# EAGLE design Payload_Computer (EAGLE 6.4)
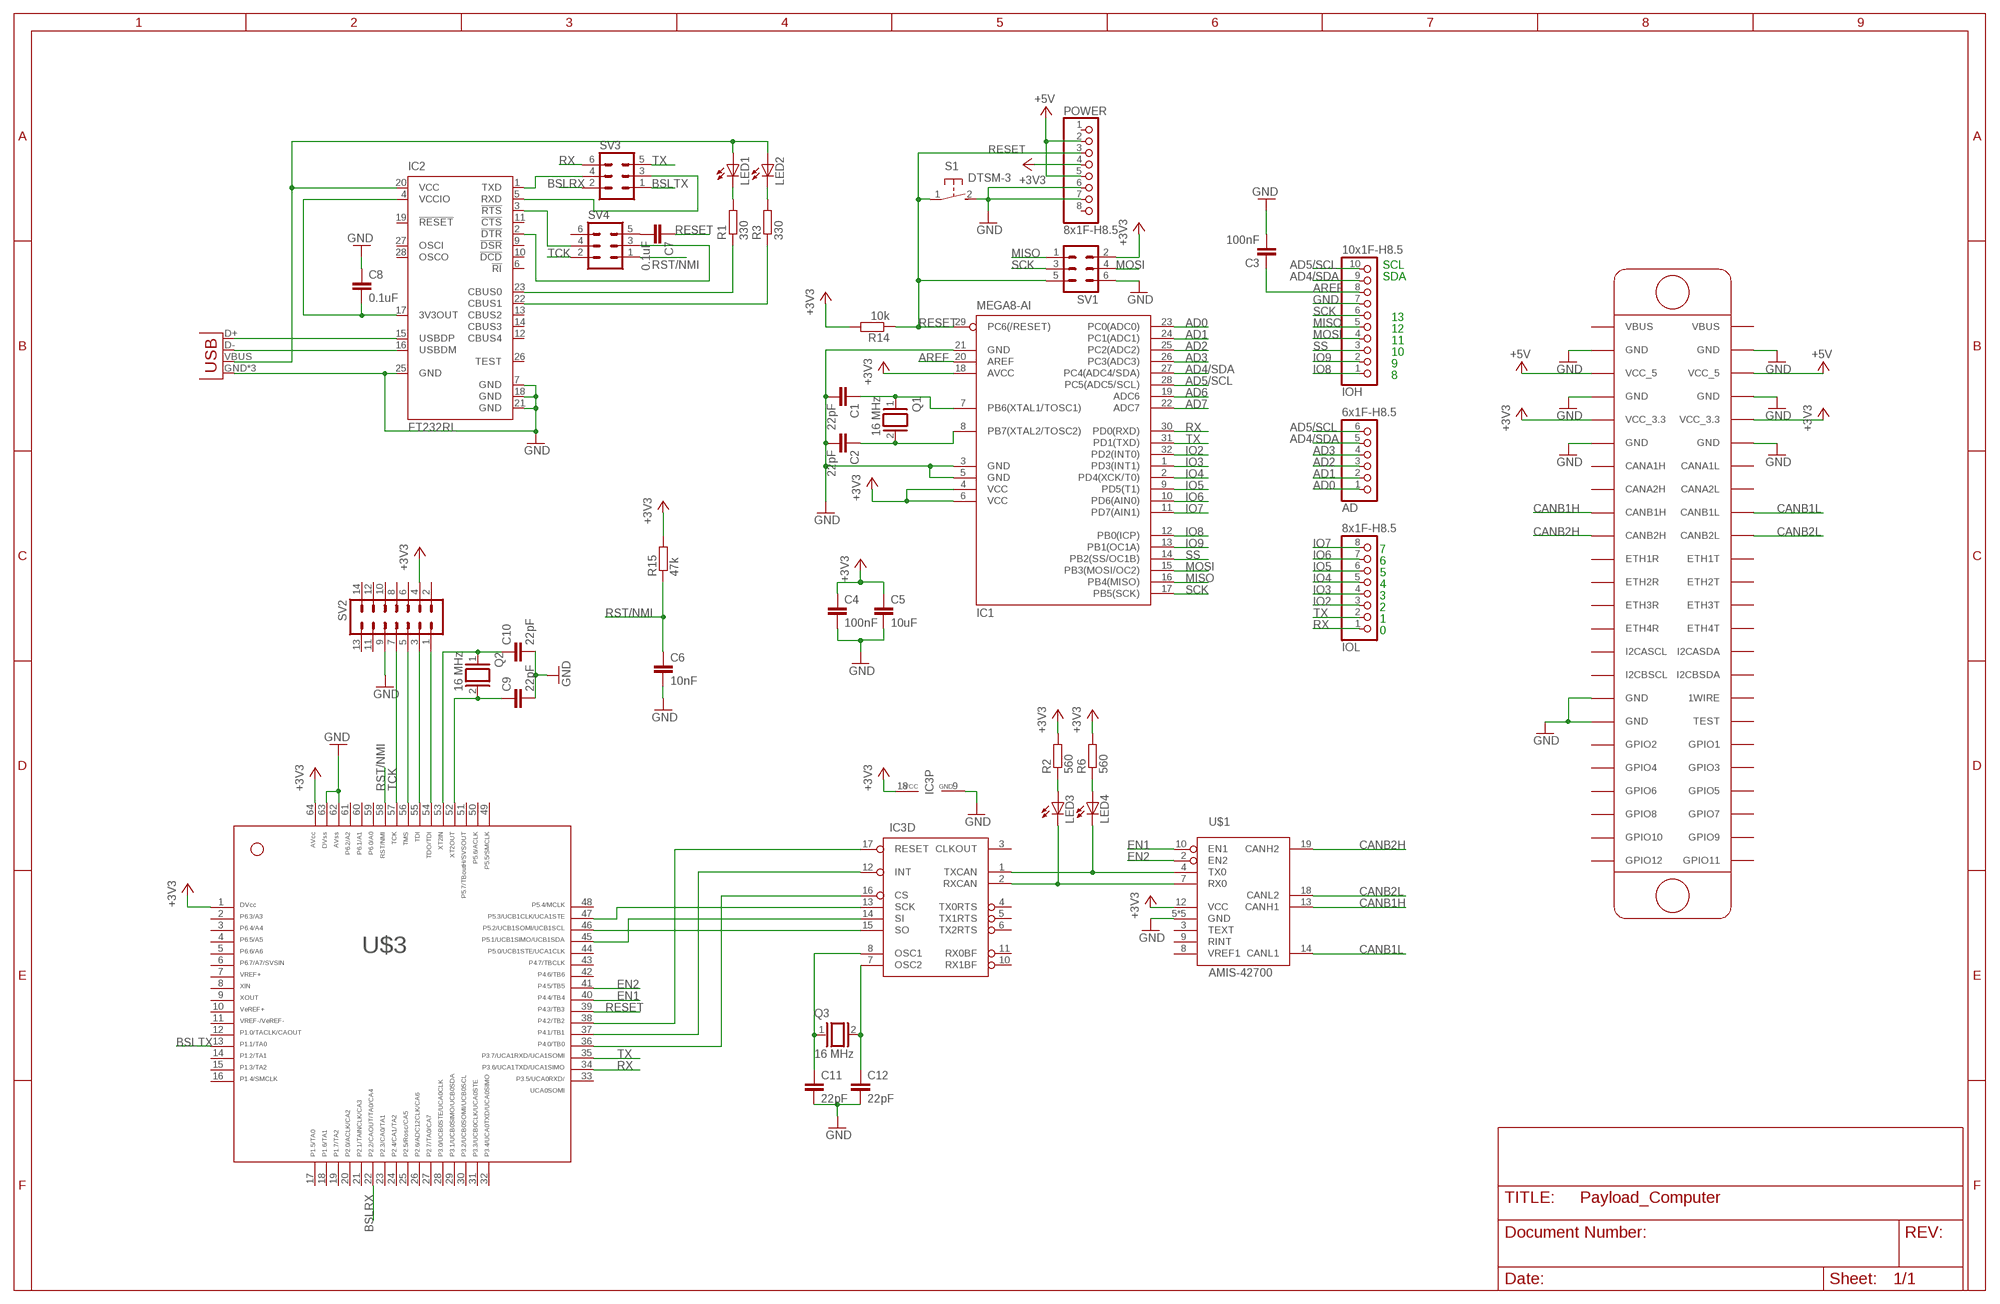
[diagram p0: schematic, sheet 1]

## Parts
AD  6x1F-H8.5  PINHD-1X6  [1X06]
C1  22pF  C-EUC0805  [C0805]
C2  22pF  C-EUC0805  [C0805]
C3  100nF  C-EUC0805  [C0805]
C4  100nF  C-EUC0805  [C0805]
C5  10uF  C-EUC0805  [C0805]
C6  10nF  C-EUC0805  [C0805]
C7  0.1uF  C-EUC0805  [C0805]
C8  0.1uF  C-EUC0805  [C0805]
C9  22pF  C-EUC0805  [C0805]
C10  22pF  C-EUC0805  [C0805]
C11  22pF  C-EUC0805  [C0805]
C12  22pF  C-EUC0805  [C0805]
IC1  MEGA8-AI  [TQFP32-08]
IC2  FT232RL  [SSOP28]
IC3  MCP2515SO  [SO-18W]
IOH  10x1F-H8.5  PINHD-1X10_ARD  [1X10]
IOL  8x1F-H8.5  PINHD-1X8  [1X08]
JP1  USB-MICROB  [USB-MICROB]
LED1  LED3MM  [LED3MM]
LED2  LED3MM  [LED3MM]
LED3  LED3MM  [LED3MM]
LED4  LED3MM  [LED3MM]
POWER  8x1F-H8.5  PINHD-1X8  [1X08]
Q1  16 MHz  XTAL/S  [QS]
Q2  16 MHz  XTAL/S  [QS]
Q3  16 MHz  XTAL/S  [QS]
R1  330  R-EU_R0805  [R0805]
R2  560  R-EU_R0805  [R0805]
R3  330  R-EU_R0805  [R0805]
R6  560  R-EU_R0805  [R0805]
R14  10k  R-EU_R0805  [R0805]
R15  47k  R-EU_R0805  [R0805]
S1  DTSM-3  [DTSM-3]
SV1  MA03-2  [MA03-2]
SV2  MA07-2  [MA07-2]
SV3  MA03-2  [MA03-2]
SV4  MA03-2  [MA03-2]
U$1  AMIS-42700  [SOIC20]
U$2  CUBESAT_PCB  [CUBESAT_PCB]
U$3  F241X---PM64  [PM/PAG64]

## Nets
+3V3: C4.1 C5.1 IC1.4(VCC) IC1.6(VCC) IC1.18(AVCC) IC3.18(P:VCC) POWER.4 R2.2 R6.2 R14.2 R15.2 SV1.2 SV2.4 U$1.12(VCC) U$2.VCC_3.3@1(VCC_3.3) U$2.VCC_3.3@2(VCC_3.3) U$3.1 U$3.64
+5V [usbvcc]: POWER.2 POWER.5 U$2.VCC_5@1(VCC_5) U$2.VCC_5@2(VCC_5)
AD0: AD.1 IC1.23(PC0(ADC0))
AD1: AD.2 IC1.24(PC1(ADC1))
AD2: AD.3 IC1.25(PC2(ADC2))
AD3: AD.4 IC1.26(PC3(ADC3))
AD4/SDA: AD.5 IC1.27(PC4(ADC4/SDA)) IOH.9
AD5/SCL: AD.6 IC1.28(PC5(ADC5/SCL)) IOH.10
AD6: IC1.19(ADC6)
AD7: IC1.22(ADC7)
AREF [aref]: C3.1 IC1.20(AREF) IOH.8
BSLRX: SV3.2 U$3.22
BSLTX: SV3.1 U$3.13
CANB1H: U$1.13(CANH1) U$2.CANB1H
CANB1L: U$1.14(CANL1) U$2.CANB1L
CANB2H: U$1.19(CANH2) U$2.CANB2H
CANB2L: U$1.18(CANL2) U$2.CANB2L
EN1: U$1.10(EN1) U$3.40
EN2: U$1.2(EN2) U$3.41
GND [gnd]: C1.2 C2.2 C3.2 C4.2 C5.2 C6.2 C8.1 C9.2 C10.2 C11.2 C12.2 IC1.3(GND) IC1.5(GND) IC1.21(GND) IC2.7(GND) IC2.18(GND) IC2.21(GND) IC2.25(GND) IC3.9(P:GND) IOH.7 JP1.GND JP1.MT1(GND) JP1.MT2(GND) POWER.6 POWER.7 S1.2 SV1.6 SV2.9 U$1.5(GND) U$1.6(GND) U$1.15(GND) U$1.16(GND) U$1.17(GND) U$2.GND@5(GND) U$2.GND@6(GND) U$2.GND@7(GND) U$2.GND@8(GND) U$2.GND@9(GND) U$2.GND@10(GND) U$2.GND@11(GND) U$2.GND@12(GND) U$3.62 U$3.63
IO2: IC1.32(PD2(INT0)) IOL.3
IO3: IC1.1(PD3(INT1)) IOL.4
IO4: IC1.2(PD4(XCK/T0)) IOL.5
IO5: IC1.9(PD5(T1)) IOL.6
IO6: IC1.10(PD6(AIN0)) IOL.7
IO7: IC1.11(PD7(AIN1)) IOL.8
IO8: IC1.12(PB0(ICP)) IOH.1
IO9: IC1.13(PB1(OC1A)) IOH.2
MISO: IC1.16(PB4(MISO)) IOH.5 SV1.1
MOSI: IC1.15(PB3(MOSI/OC2)) IOH.4 SV1.4
N$1: IC3.1(D:TXCAN) LED4.K(C) U$1.4(TX0)
N$2: C12.1 IC3.7(D:OSC2) Q3.2
N$3: IC3.2(D:RXCAN) LED3.K(C) U$1.7(RX0)
N$4: C8.2 IC2.4(VCCIO) IC2.17(3V3OUT)
N$5: IC2.15(USBDP) JP1.D+
N$6: IC2.16(USBDM) JP1.D-
N$7: IC2.20(VCC) JP1.VBUS LED1.A LED2.A
N$8: LED1.K(C) R1.2
N$9: LED2.K(C) R3.2
N$10: IC2.23(CBUS0) R1.1
N$11: IC2.22(CBUS1) R3.1
N$12: LED3.A R2.1
N$13: LED4.A R6.1
N$14: C7.2 SV4.5
N$15: IC2.1(TXD) SV3.4
N$16: IC2.5(RXD) SV3.3
N$17: IC2.2(!DTR) SV4.3
N$18: C1.1 IC1.7(PB6(XTAL1/TOSC1)) Q1.1
N$19: C2.1 IC1.8(PB7(XTAL2/TOSC2)) Q1.2
N$20: C11.1 IC3.8(D:OSC1) Q3.1
N$23: SV2.1 U$3.54
N$24: SV2.3 U$3.55
N$25: SV2.5 U$3.56
N$26: IC2.3(!RTS) SV4.4
N$27: IC3.15(D:SO) U$3.46
N$28: IC3.14(D:SI) U$3.45
N$29: IC3.13(D:SCK) U$3.47
N$31: IC3.16(D:CS) U$3.36
N$32: IC3.12(D:INT) U$3.37
N$33: IC3.17(D:RESET) U$3.38
RESET: C7.1 IC1.29(PC6(/RESET)) POWER.3 R14.1 S1.1 SV1.5 U$3.39
RST/NMI: C6.1 R15.1 SV4.1 U$3.58
RX: IC1.30(PD0(RXD)) IOL.1 SV3.6 U$3.34
SCK: IC1.17(PB5(SCK)) IOH.6 SV1.3
SS: IC1.14(PB2(SS/OC1B)) IOH.3
TCK: SV2.7 SV4.2 U$3.57
TX: IC1.31(PD1(TXD)) IOL.2 SV3.5 U$3.35
XT2IN: C10.1 Q2.1 U$3.53
XT2OUT: C9.1 Q2.2 U$3.52
Unconnected: IC2.6(!RI) IC2.9(!DSR) IC2.10(!DCD) IC2.11(!CTS) IC2.12(CBUS4) IC2.13(CBUS2) IC2.14(CBUS3) IC2.19(!RESET) IC2.26(TEST) IC2.27(OSCI) IC2.28(OSCO) IC3.3(D:CLKOUT) IC3.4(D:TX0RTS) IC3.5(D:TX1RTS) IC3.6(D:TX2RTS) IC3.10(D:RX1BF) IC3.11(D:RX0BF) POWER.1 POWER.8 SV2.2 SV2.6 SV2.8 SV2.10 SV2.11 SV2.12 SV2.13 SV2.14 SV4.6 U$1.3(TEXT) U$1.8(VREF1) U$1.9(RINT) U$2.1WIRE U$2.CANA1H U$2.CANA1L U$2.CANA2H U$2.CANA2L U$2.ETH1R U$2.ETH1T U$2.ETH2R U$2.ETH2T U$2.ETH3R U$2.ETH3T U$2.ETH4R U$2.ETH4T U$2.GPIO1 U$2.GPIO2 U$2.GPIO3 U$2.GPIO4 U$2.GPIO5 U$2.GPIO6 U$2.GPIO7 U$2.GPIO8 U$2.GPIO9 U$2.GPIO10 U$2.GPIO11 U$2.GPIO12 U$2.I2CASCL U$2.I2CASDA U$2.I2CBSCL U$2.I2CBSDA U$2.TEST U$2.VBUS@1(VBUS) U$2.VBUS@2(VBUS) U$3.2 U$3.3 U$3.4 U$3.5 U$3.6 U$3.7 U$3.8 U$3.9 U$3.10 U$3.11 U$3.12 U$3.14 U$3.15 U$3.16 U$3.17 U$3.18 U$3.19 U$3.20 U$3.21 U$3.23 U$3.24 U$3.25 U$3.26 U$3.27 U$3.28 U$3.29 U$3.30 U$3.31 U$3.32 U$3.33 U$3.42 U$3.43 U$3.44 U$3.48 U$3.49 U$3.50 U$3.51 U$3.59 U$3.60 U$3.61

## Notes on the sheet
- SCL
- SDA
- 13
- 12
- 11
- 10
- 9
- 8
- 7
- 6
- 5
- 4
- 3
- 2
- 1
- 0

## Library data of the parts
AD = SmartPrj:PINHD-1X6: PIN HEADER
C1-C12 = resistor:C-EU: CAPACITOR, European symbol
IC1 = atmel:MEGA8: MICROCONTROLLER 8 Kbytes FLASH, 1 kbytes SRAM, 512 bytes EEPROM, USART, 6-channel 10 bit ADC, 2-channel 8 bit ADC Pin compatible with Atmega48, ATMega88, ATMega168 Source: avr.lbr; MPN: ATMEGA8-16AU; OC_FARNELL: 9171371; OC_NEWARK: 73M8863
IC2 = ftdichip:FT232R: Source: http://www.ftdichip.com/Documents/DataSheets/DS_FT232R_v104.pdf; MPN: FT232RL; OC_FARNELL: 1146032; OC_NEWARK: 91K9918
IC3 = can:MCP2515: MC2515 Stand-Alone CAN Controller With SPI Interface, Microchip
IOH = SmartPrj:PINHD-1X10_ARD: PIN HEADER
IOL POWER = SmartPrj:PINHD-1X8: PIN HEADER
JP1 = SparkFun-Connectors:USB: USB Connectors USB-B-PTH is fully proven SKU : PRT-00139/CONN-08278 USB-miniB is fully proven SKU : PRT-00587 USB-A-PCB is untested. USB-A-H is throughly reviewed, but untested. Spark Fun Electronics SKU : PRT-00437 USB-B-SMT is throughly reviewed, but untested. Needs silkscreen touching up. USB-A-S has not been used/tested USB-MB-H has not been used/tested USB-MICROB has been used. CONN-09505; PROD_ID: CONN-09505
LED1-LED4 = SparkFun-LED:LED: LEDs Standard schematic elements and footprints for 5mm, 3mm, 1206, and 0603 sized LEDs. 5mm - Spark Fun Electronics SKU : COM-00529 (and others)
Q1-Q3 = special:XTAL/S: CRYSTAL
R1-R3 R6 R14 R15 = resistor:R-EU_: RESISTOR, European symbol
S1 = switch-tact:DTSM-3
SV1 SV3 SV4 = con-lstb:MA03-2: PIN HEADER; OC_FARNELL: unknown; OC_NEWARK: unknown
SV2 = con-lstb:MA07-2: PIN HEADER; OC_FARNELL: unknown; OC_NEWARK: unknown
U$1 = amis-42700:AMIS-42700
U$2 = CubeSat_PCB:CUBESAT_PCB: OpenCube PCB
U$3 = TI_MSP430_v16:F241X---PM64: ***MSP430F241x***PM64

## Net classes
0 default: width 0.152 mm, clearance 0.152 mm
1 power: width 0.152 mm, drill 0.61 mm, clearance 0.152 mm
2 gnd: width 0.152 mm, drill 0.559 mm, clearance 0.152 mm
3 usbvcc: width 0.152 mm, drill 0.61 mm, clearance 0.152 mm
4 aref: width 0.152 mm, drill 0.61 mm, clearance 0.152 mm

## Board
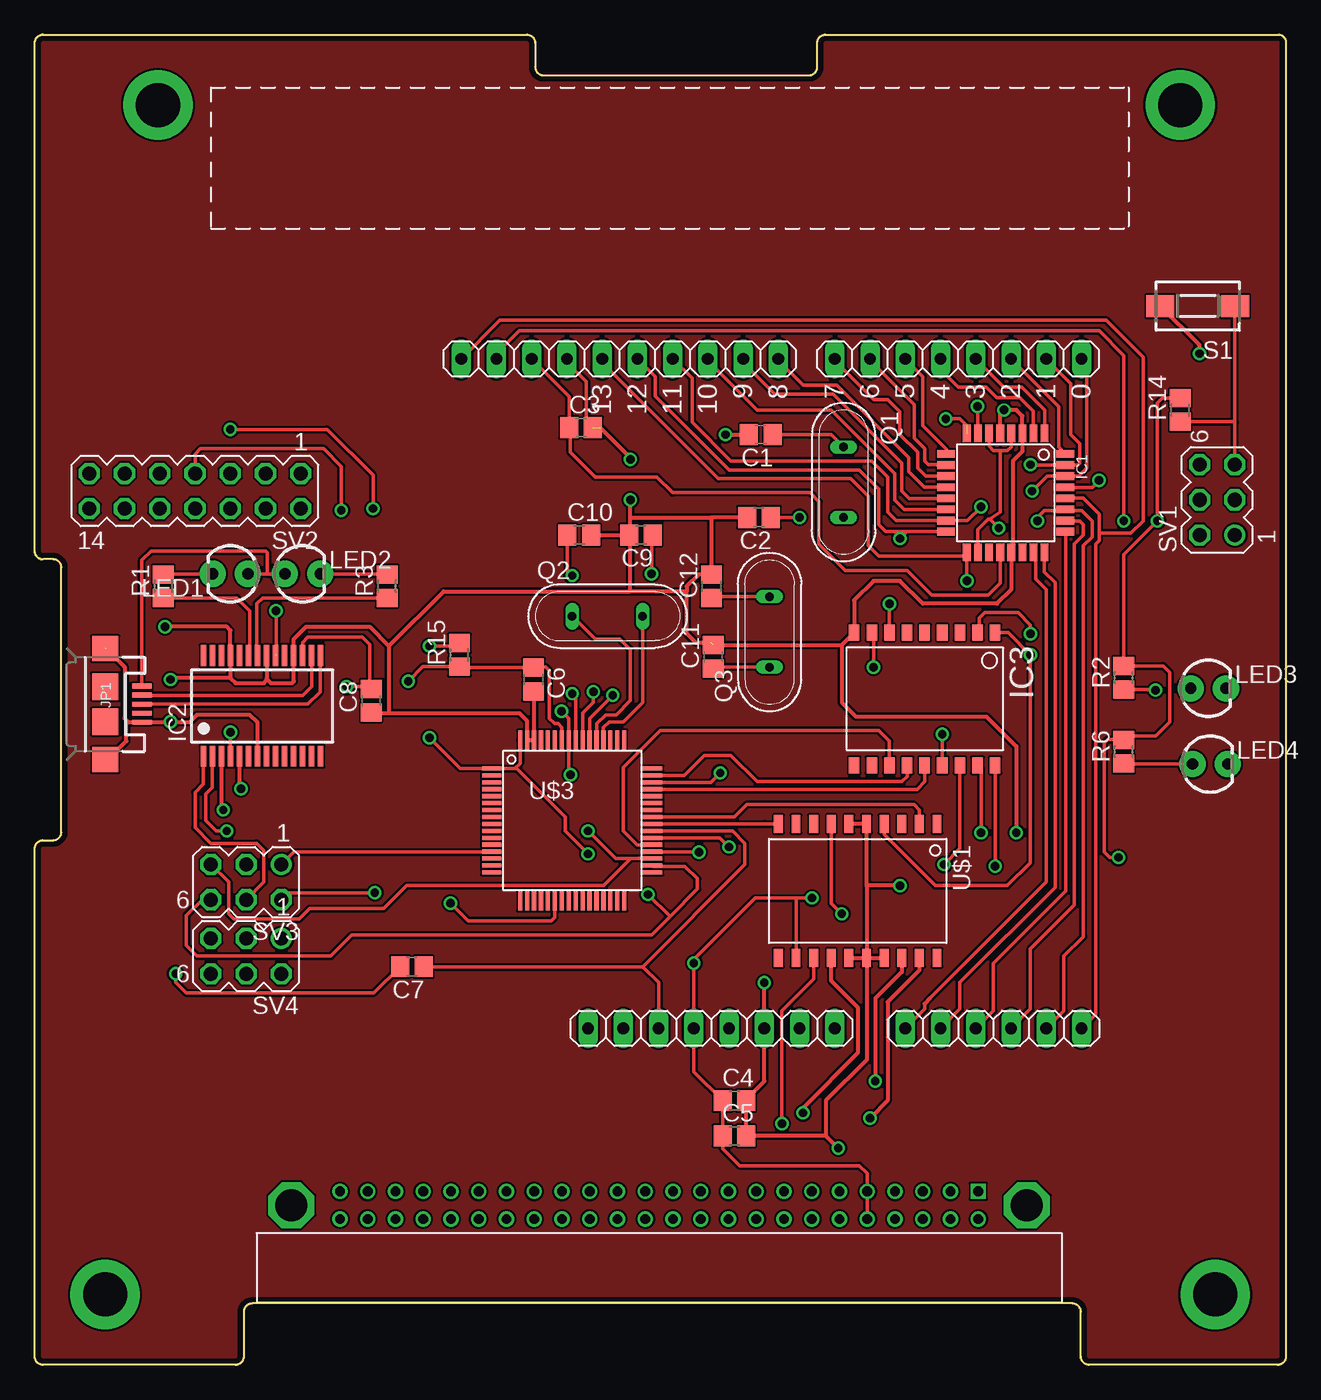
[diagram p1: board, top side]
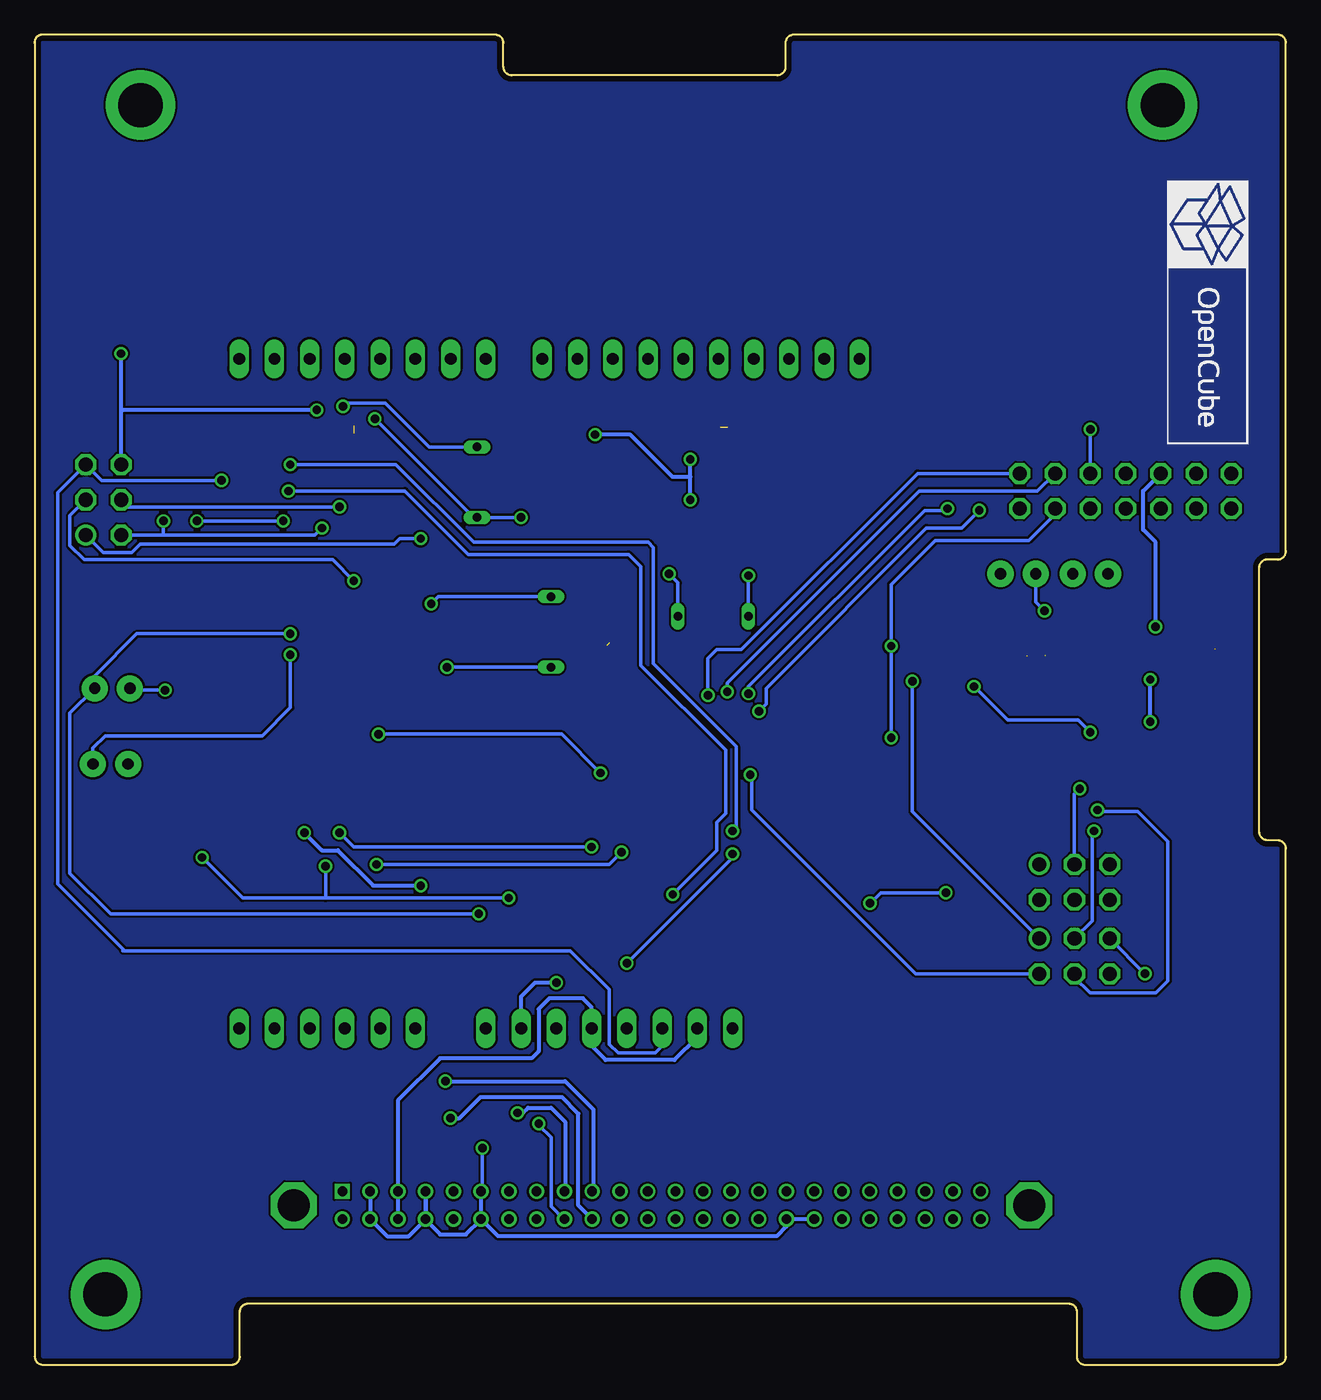
[diagram p2: board, bottom side, seen from below]

Size 90.17 x 95.89 mm. Coordinates in mm from the lower left corner, seen from the top.
Copper layers (1*16): Top 0.0356mm / dielectric 1.5011mm / Bottom 0.0356mm
Design rules "LaenPCBOrder": minimum track width 6mil, minimum drill 13mil, track to track 6mil, track to pad 6mil, pad to pad 6mil, via to via 6mil, smd to smd 6mil, copper to edge 15mil, drill to drill 6mil, minimum pad ring 7mil, minimum via ring 7mil, stop-mask expansion 3mil, vias tented up to drill 0mil, thermal gap 10mil

### Footprints (pad centres in the part's own frame; a part is rotated, then mirrored left to right if it is on the bottom)
1X06 = drill 0.85 pad 1.422 long: 1 -6.35,0; 2 -3.81,0; 3 -1.27,0; 4 1.27,0; 5 3.81,0; 6 6.35,0
C0805 = smd 1.3 x 1.5: 1 -0.85,0; 2 0.85,0
TQFP32-08 = smd 1.27 x 0.559: 1 -4.293,2.8; 2 -4.293,2; 3 -4.293,1.2; 4 -4.293,0.4; 5 -4.293,-0.4; 6 -4.293,-1.2; 7 -4.293,-2; 8 -4.293,-2.8; 17 4.293,-2.8; 18 4.293,-2; 19 4.293,-1.2; 20 4.293,-0.4; 21 4.293,0.4; 22 4.293,1.2; 23 4.293,2; 24 4.293,2.8 | smd 0.559 x 1.27: 9 -2.8,-4.293; 10 -2,-4.293; 11 -1.2,-4.293; 12 -0.4,-4.293; 13 0.4,-4.293; 14 1.2,-4.293; 15 2,-4.293; 16 2.8,-4.293; 25 2.8,4.293; 26 2,4.293; 27 1.2,4.293; 28 0.4,4.293; 29 -0.4,4.293; 30 -1.2,4.293; 31 -2,4.293; 32 -2.8,4.293
SSOP28 = smd 0.4 x 1.5: 1 -4.225,-3.625; 2 -3.575,-3.625; 3 -2.925,-3.625; 4 -2.275,-3.625; 5 -1.625,-3.625; 6 -0.975,-3.625; 7 -0.325,-3.625; 8 0.325,-3.625; 9 0.975,-3.625; 10 1.625,-3.625; 11 2.275,-3.625; 12 2.925,-3.625; 13 3.575,-3.625; 14 4.225,-3.625; 15 4.225,3.625; 16 3.575,3.625; 17 2.925,3.625; 18 2.275,3.625; 19 1.625,3.625; 20 0.975,3.625; 21 0.325,3.625; 22 -0.325,3.625; 23 -0.975,3.625; 24 -1.625,3.625; 25 -2.275,3.625; 26 -2.925,3.625; 27 -3.575,3.625; 28 -4.225,3.625
SO-18W = smd 0.762 x 1.143: 1 -5.08,-4.788; 2 -3.81,-4.788; 3 -2.54,-4.788; 4 -1.27,-4.788; 5 0,-4.788; 6 1.27,-4.788; 7 2.54,-4.788; 8 3.81,-4.788; 9 5.08,-4.788; 10 5.08,4.788; 11 3.81,4.788; 12 2.54,4.788; 13 1.27,4.788; 14 0,4.788; 15 -1.27,4.788; 16 -2.54,4.788; 17 -3.81,4.788; 18 -5.08,4.788
1X10@1 = drill 0.85 pad 1.422 long: 1 -11.43,0; 2 -8.89,0; 3 -6.35,0; 4 -3.81,0; 5 -1.27,0; 6 1.27,0; 7 3.81,0; 8 6.35,0; 9 8.89,0; 10 11.43,0
1X08 = drill 0.85 pad 1.422 long: 1 -8.89,0; 2 -6.35,0; 3 -3.81,0; 4 -1.27,0; 5 1.27,0; 6 3.81,0; 7 6.35,0; 8 8.89,0
USB-MICROB = smd 0.35 x 1.4: D+ 0,2.65; D- -0.65,2.65; GND 1.3,2.65; ID 0.65,2.65; VBUS -1.3,2.65 | smd 1.8 x 1.9: MT1 -4,0; MT2 4,0 | smd 1.9 x 1.9: P$1 -1.27,0; P$2 1.27,0
LED3MM = drill 0.813 pad 1.88: A -1.27,0; K 1.27,0
QS = drill 0.61 long: 1 -2.54,0; 2 2.54,0
R0805 = smd 1.3 x 1.5: 1 -0.85,0; 2 0.85,0
DTSM-3 = smd 2 x 1.6: 1 -2.7,0; 2 2.7,0
MA03-2 = drill 1.016: 1 -2.54,-1.27 | drill 1.016 octagon: 2 -2.54,1.27; 3 0,-1.27; 4 0,1.27; 5 2.54,-1.27; 6 2.54,1.27
MA07-2 = drill 1.016 octagon: 1 -7.62,-1.27; 2 -7.62,1.27; 3 -5.08,-1.27; 4 -5.08,1.27; 5 -2.54,-1.27; 6 -2.54,1.27; 7 0,-1.27; 8 0,1.27; 9 2.54,-1.27; 10 2.54,1.27; 11 5.08,-1.27; 12 5.08,1.27; 13 7.62,-1.27; 14 7.62,1.27
SOIC20 = smd 1.27 x 0.635: 1 -4.826,5.715; 2 -4.826,4.445; 3 -4.826,3.175; 4 -4.826,1.905; 5 -4.826,0.635; 6 -4.826,-0.635; 7 -4.826,-1.905; 8 -4.826,-3.175; 9 -4.826,-4.445; 10 -4.826,-5.715; 11 4.826,-5.715; 12 4.826,-4.445; 13 4.826,-3.175; 14 4.826,-1.905; 15 4.826,-0.635; 16 4.826,0.635; 17 4.826,1.905; 18 4.826,3.175; 19 4.826,4.445; 20 4.826,5.715
CUBESAT_PCB = drill 0.7 pad 1.1: 1WIRE 36,12.5; CANA1H 56,10.5; CANA1L 56,12.5; CANA2H 54,10.5; CANA2L 54,12.5; CANB1H 52,10.5; CANB1L 52,12.5; CANB2H 50,10.5; CANB2L 50,12.5; ETH1R 48,10.5; ETH1T 48,12.5; ETH2R 46,10.5; ETH2T 46,12.5; ETH3R 44,10.5; ETH3T 44,12.5; ETH4R 42,10.5; ETH4T 42,12.5; GND@5 66,12.5; GND@6 66,10.5; GND@7 62,12.5; GND@8 62,10.5; GND@9 58,12.5; GND@10 58,10.5; GND@11 36,10.5; GND@12 34,10.5; GPIO1 32,12.5; GPIO2 32,10.5; GPIO3 30,12.5; GPIO4 30,10.5; GPIO5 28,12.5; GPIO6 28,10.5; GPIO7 26,12.5; GPIO8 26,10.5; GPIO9 24,12.5; GPIO10 24,10.5; GPIO11 22,12.5; GPIO12 22,10.5; I2CASCL 40,10.5; I2CASDA 40,12.5; I2CBSCL 38,10.5; I2CBSDA 38,12.5; TEST 34,12.5; VBUS@2 68,10.5; VCC_3.3@1 60,12.5; VCC_3.3@2 60,10.5; VCC_5@1 64,12.5; VCC_5@2 64,10.5 | drill 3.18 pad 5: GND@1 5.08,5.08; GND@2 8.89,90.81; GND@3 82.55,90.81; GND@4 85.08,5.08 | drill 2.3 pad 3.2 octagon: GND@13 18.5,11.5; GND@14 71.5,11.5 | drill 0.7 pad 1.1 square: VBUS@1 68,12.5
PM/PAG64 = smd 1.4 x 0.3: 1 -5.8,3.75; 2 -5.8,3.25; 3 -5.8,2.75; 4 -5.8,2.25; 5 -5.8,1.75; 6 -5.8,1.25; 7 -5.8,0.75; 8 -5.8,0.25; 9 -5.8,-0.25; 10 -5.8,-0.75; 11 -5.8,-1.25; 12 -5.8,-1.75; 13 -5.8,-2.25; 14 -5.8,-2.75; 15 -5.8,-3.25; 16 -5.8,-3.75; 33 5.8,-3.75; 34 5.8,-3.25; 35 5.8,-2.75; 36 5.8,-2.25; 37 5.8,-1.75; 38 5.8,-1.25; 39 5.8,-0.75; 40 5.8,-0.25; 41 5.8,0.25; 42 5.8,0.75; 43 5.8,1.25; 44 5.8,1.75; 45 5.8,2.25; 46 5.8,2.75; 47 5.8,3.25; 48 5.8,3.75 | smd 0.3 x 1.4: 17 -3.75,-5.8; 18 -3.25,-5.8; 19 -2.75,-5.8; 20 -2.25,-5.8; 21 -1.75,-5.8; 22 -1.25,-5.8; 23 -0.75,-5.8; 24 -0.25,-5.8; 25 0.25,-5.8; 26 0.75,-5.8; 27 1.25,-5.8; 28 1.75,-5.8; 29 2.25,-5.8; 30 2.75,-5.8; 31 3.25,-5.8; 32 3.75,-5.8; 49 3.75,5.8; 50 3.25,5.8; 51 2.75,5.8; 52 2.25,5.8; 53 1.75,5.8; 54 1.25,5.8; 55 0.75,5.8; 56 0.25,5.8; 57 -0.25,5.8; 58 -0.75,5.8; 59 -1.25,5.8; 60 -1.75,5.8; 61 -2.25,5.8; 62 -2.75,5.8; 63 -3.25,5.8; 64 -3.75,5.8

### Placement (x,y rotation side)
AD  69.09,24.26 0 top
C1  52.32,67.06 180 top
C2  52.2,61.09 180 top
C3  39.37,67.56 0 top
C4  50.42,19.05 0 top
C5  50.42,16.51 0 top
C6  35.94,49.4 270 top
C7  27.18,28.7 180 top
C8  24.26,47.88 90 top
C9  43.69,59.82 180 top
C10  39.24,59.82 0 top
C11  48.9,51.05 90 top
C12  48.77,56.13 90 top
IC1  69.98,62.87 270 top
IC2  16.38,47.5 0 top
IC3  64.14,48.01 180 top
IOH  10x1F-H8.5  [1X10@1]  42.16,72.52 180 top
IOL  66.55,72.52 180 top
JP1  5.08,47.62 270 top
LED1  14.1,57.02 180 top
LED2  19.3,57.02 0 top
LED3  84.58,48.77 0 top
LED4  84.71,43.31 0 top
POWER  48.77,24.26 0 top
Q1  58.29,63.63 270 top
Q2  41.27,53.98 0 top
Q3  52.96,52.83 90 top
R1  9.27,56.13 90 top
R2  78.49,49.53 90 top
R3  25.4,56.13 90 top
R6  78.49,44.2 90 top
R14  82.55,68.83 90 top
R15  30.61,51.18 90 top
S1  83.82,76.33 180 top
SV1  85.22,62.36 90 top
SV2  11.56,62.99 180 top
SV3  15.24,34.8 180 top
SV4  15.24,29.46 180 top
U$1  59.31,34.16 270 top
U$2  0,0 0 top
U$3  38.73,39.24 0 top

### Tracks (layer width: path | path; a pad name or v marks a point on that pad's centre or on a via)
+3V3  (via drill 0.6)
  Top 0.254: IC1.6 68.78,66.22 69.09,65.91 69.6,65.91 | 69.6,65.91 70.1,65.91 70.36,66.17 70.36,67.14 IC1.4 | IC1.18 67.98,60.23 68.71,60.96 68.83,60.96 | 69.6,65.91 69.6,61.47 68.83,60.96 | v69.47,60.33 68.83,60.96 | R14.2 81.24,69.68 80.9,69.34 v80.9,60.83 78.49,58.42 R2.2 81.32,50.38 81.79,49.91 81.79,46.36 80.77,45.34 78.78,45.34 R6.2 78.45,45.09 77.34,45.09 77.09,44.83 77.09,36.96 77.47,36.58 v78.11,36.58 | v28.45,45.21 30.67,42.99 U$3.1 34.61,42.99 | 30.39,51.82 R15.2 30.1,52.03 30.1,51.82 v28.45,51.82 | 54.86,29.08 U$1.12 54.86,33.66 | IC3.18 v69.22,35.94 | U$3.64 34.98,43.37 34.61,42.99 | 34.61,42.99 34.73,42.99 38.23,39.5 38.23,38.48 v39.88,36.83 | U$2.VCC_3.3@2 U$2.VCC_3.3@1 60,13.79 59.44,14.35 50.8,14.35 49.57,15.58 C5.1 C4.1 47.5,21.12 POWER.4 v47.5,28.96 47.5,29.21 51.94,33.66 54.86,33.66 | 54.86,33.66 v56.01,33.66
  Bottom 0.254: SV1.2 80.9,59.82 | 80.9,59.82 69.98,59.82 v69.47,60.33 | v80.9,60.83 80.9,59.82 | v28.45,45.21 v28.45,51.82 28.45,56.26 25.27,59.44 18.54,59.44 16.64,61.34 SV2.4 | v56.01,33.66 69.22,33.66 | 69.22,33.66 75.18,33.66 v78.11,36.58 | v69.22,35.94 69.22,33.66 | v39.88,36.83 39.88,36.58 v47.5,28.96
+5V
  Bottom 0.305: POWER.2 42.42,23.62 44.07,21.97 49.02,21.97 50.04,22.99 POWER.5 50.04,25.78 50.67,26.42 53.09,26.42 53.85,25.65 53.85,22.61 54.36,22.1 60.96,22.1 64.01,19.05 U$2.VCC_5@1 U$2.VCC_5@2
AD0
  Top 0.254: IC1.23 72.14,58.41 72.14,56.64 72.9,55.88 72.9,34.8 64.52,26.42 | 64.14,26.04 64.14,25.65 AD.1
  Top 0.305: 64.52,26.42 64.14,26.04
AD1
  Top 0.254: IC1.24 72.77,57.15 73.53,56.39 73.53,34.42 66.67,27.56 66.67,25.65 AD.2
AD2
  Top 0.254: IC1.25 74.3,60.04 74.3,34.16 69.09,28.96 69.09,25.53 AD.3
AD3
  Top 0.254: IC1.26 74.3,60.83 75.31,60.83 75.56,60.58 75.56,59.82 74.93,59.18 74.93,33.15 71.75,29.97 71.75,25.65 AD.4
AD4/SDA  (via drill 0.6)
  Top 0.254: v78.49,60.83 78.49,72.77 76.71,74.55 34.93,74.55 33.27,72.9 IOH.9 | v72.26,60.83 72.26,61.09 72.77,61.59 74.2,61.59 IC1.27 74.34,61.59 75.44,61.59 76.2,60.83 76.2,59.69 75.56,59.06 75.56,30.86 74.17,29.46 74.17,25.53 AD.5
  Bottom 0.254: v78.49,60.83 v72.26,60.83
AD5/SCL
  Top 0.254: 76.71,60.07 76.71,59.44 76.45,59.18 76.45,25.27 AD.6 | 76.71,60.07 76.71,61.34 75.56,62.48 74.29,62.48 IC1.28 | 76.71,60.07 76.84,59.94 78.99,59.94 79.88,60.83 79.88,72.64 77.22,75.31 33.53,75.31 IOH.10
AREF
  Top 0.254: IOH.8 38.52,69.81 C3.1 38.61,67.48 38.61,65.79 40.39,64.01 44.83,64.01 45.97,62.87 55.88,62.87 56.52,62.23 56.52,59.18 58.42,57.28 62.87,57.28 64.64,55.5 68.71,55.5 69.58,56.37 IC1.20
BSLRX  (via drill 0.6)
  Top 0.254: U$3.22 37.47,33.42 37.47,32.26 37.21,32 31.24,32 v29.97,33.27 | v24.51,34.04 18.29,34.04 SV3.2
  Bottom 0.254: v24.51,34.04 29.21,34.04 v29.97,33.27
BSLTX
  Top 0.254: U$3.13 32.9,36.96 18.67,36.96 SV3.1
CANB1H  (via drill 0.6)
  Top 0.254: v53.85,17.4 53.85,25.53 56.13,27.81 U$1.13
  Bottom 0.254: U$2.CANB1H 52.03,10.5 52.96,11.43 52.96,16.38 53.85,17.27 v53.85,17.4
CANB1L  (via drill 0.6)
  Top 0.305: v55.37,18.16 55.37,18.54 59.31,22.48 59.31,25.78 57.4,27.69 U$1.14
  Bottom 0.305: U$2.CANB1L 51.94,12.56 51.94,17.53 52.96,18.54 54.61,18.54 54.99,18.16 v55.37,18.16
CANB2H  (via drill 0.6)
  Top 0.305: U$1.19 63.75,28.45 61.47,26.16 61.47,19.05 v60.2,17.78
  Bottom 0.305: v60.2,17.78 59.56,17.78 58.04,19.3 52.2,19.3 50.99,18.1 50.99,11.49 U$2.CANB2H
CANB2L  (via drill 0.6)
  Top 0.305: U$1.18 62.48,28.32 60.58,26.42 v60.58,20.45
  Bottom 0.305: v60.58,20.45 51.94,20.45 49.91,18.42 49.91,12.59 U$2.CANB2L
EN1
  Top 0.254: U$3.40 52.58,38.99 U$1.10
EN2
  Top 0.254: U$3.41 50.42,39.5 51.31,40.39 63.37,40.39 63.75,40.01 U$1.2
GND  (via drill 0.6)  (4 unrouted)
  Top 0.254: IOH.7 38.35,72.26 39.75,70.87 39.75,68.03 C3.2
  Top 0.305: U$1.16 U$1.17 | U$1.15 U$1.16 | U$1.16 59.94,21.97 57.02,19.05 57.02,16.51 | IC1.5 69.58,68.56 v69.85,68.83 70.74,68.83 71.18,68.4 IC1.3 71.18,65.84 70.48,65.15 70.48,58.68 IC1.21 70.38,55.9 69.34,54.86 64.01,54.86 62.36,56.52 60.45,56.52 59.05,55.12 IC3.9 58.17,51.9 | v83.95,72.9 83.95,73.53 83.91,73.53 S1.2 | v49.78,67.06 C1.2 | C10.2 C9.2 | 42.93,59.91 42.93,60.33 | 42.93,61.09 v42.93,62.36 | C9.2 42.84,60.24 42.93,60.33 | 42.93,60.33 42.93,61.09 | 42.93,61.09 48.77,61.09 | C2.2 48.77,61.09 | 48.77,61.09 48.77,57.62 48.13,56.98 | v42.93,65.28 42.93,65.41 40.77,67.56 | 5.14,51.62 6.48,50.29 6.48,46.61 6.73,46.36 | 6.73,46.36 7.7,46.36 JP1.GND 7.76,46.36 v9.78,46.36 11.18,46.36 11.68,46.86 15.49,46.86 16.06,46.3 IC2.7 | JP1.MT2 5.27,43.62 6.6,44.96 6.6,46.23 6.73,46.36 | v9.4,53.21 13.84,53.21 14.11,52.95 IC2.25 14.1,51.11 14.1,49.53 | 18.67,51.13 18.67,52.32 19.56,53.21 24.13,53.21 25.53,51.82 | 25.53,51.82 25.53,46.99 | C12.2 47.84,56.98 46.99,56.13 46.99,55.75 | 46.99,55.75 46.99,52.71 47.62,52.07 48.73,52.07 | 25.53,51.82 29.46,55.75 42.93,55.75 | C11.2 58.17,51.9 | 58.17,51.9 58.17,47.75 59.18,46.74 68.58,46.74 70.74,44.58 v70.74,38.35 | v62.36,34.54 59.94,34.54 | 59.94,34.54 U$1.5 U$1.6 | 59.94,34.54 U$1.16 | 57.02,16.51 v57.91,15.62 | 57.02,16.51 C5.2 C4.2 51.27,19.14 52.58,20.45 POWER.6 v52.58,27.56 | 14.1,49.53 14.48,49.15 16.51,49.15 16.76,49.4 | 16.76,49.4 17.02,49.15 18.54,49.15 18.67,49.28 18.67,51.11 IC2.18 | 25.53,46.99 25.49,47.03 25.45,46.99 24.77,46.99 24.73,47.03 C8.1 | 25.53,46.99 34.93,46.99 35.48,46.43 U$3.63 U$3.62 35.98,48.51 C6.2 | IC2.21 16.71,49.46 16.76,49.4
  Top 0.305: 42.93,55.75 42.93,59.73 C9.2 | 46.99,55.75 42.93,55.75 | 14.1,49.53 9.91,49.53 v9.78,49.4
  Bottom 0.254: v57.91,15.62 57.91,12.59 U$2.GND@9
  Bottom 0.305: SV1.6 83.95,68.71 | 83.95,68.71 v83.95,72.9 | 83.95,68.71 83.82,68.83 v69.85,68.83 | 42.93,64.01 44.2,64.01 47.24,67.06 v49.78,67.06 | v42.93,62.36 42.93,64.01 | 42.93,64.01 v42.93,65.28 | v9.78,46.36 v9.78,49.4 | v9.4,53.21 9.4,59.31 10.29,60.2 10.29,62.99 SV2.9 | v70.74,38.35 69.47,37.08 68.33,37.08 65.79,34.54 v62.36,34.54 | U$2.GND@5 U$2.GND@6 64.77,9.27 63.23,9.27 U$2.GND@8 U$2.GND@7 62,10.44 60.96,9.4 59.1,9.4 U$2.GND@10 | U$2.GND@10 U$2.GND@9 | U$2.GND@10 56.77,9.27 36.7,9.27 36,9.97 U$2.GND@11 U$2.GND@12 | POWER.7 55.12,26.54 54.1,27.56 v52.58,27.56
IO2
  Top 0.254: IOL.3 73.79,69.09 73.79,66.15 IC1.32
IO3
  Top 0.254: IC1.1 72.78,68.83 71.12,70.48 69.85,70.48 IOL.4
IO4
  Top 0.254: IC1.2 71.98,68.74 70.99,69.72 69.34,69.72 68.58,70.48 66.55,70.48 65.28,71.75 IOL.5
IO5
  Top 0.254: IC1.9 65.68,66.02 64.01,67.69 64.01,71.25 IOL.6
IO6
  Top 0.254: IC1.10 65.06,64.87 65.02,64.9 64.39,64.9 64.14,65.15 64.14,66.04 63.37,66.8 63.37,69.22 61.79,70.8 61.47,71.12 60.2,72.39 IOL.7
IO7
  Top 0.254: IC1.11 64.2,64.06 63.63,64.64 63.63,65.79 62.36,67.06 62.36,68.71 61.47,69.6 60.45,69.6 59.31,70.74 58.93,71.12 57.66,72.39 IOL.8
IO8
  Top 0.254: IC1.12 64.12,63.27 62.99,64.39 62.99,65.41 57.79,70.61 55.37,70.61 53.59,72.39 IOH.1
IO9
  Top 0.254: IC1.13 63.01,62.47 62.48,62.99 62.48,65.02 57.53,69.98 53.34,69.98 51.05,72.26 IOH.2
MISO  (via drill 0.6)
  Top 0.254: IC1.16 62.86,60.07 | 62.86,60.07 v62.36,59.56 | 62.86,60.07 61.35,60.07 60.83,60.58 60.83,63.12 59.44,64.52 50.04,64.52 44.7,69.85 44.7,71.25 IOH.5
  Bottom 0.254: SV1.1 85.22,58.55 83.19,58.55 82.55,59.18 64.26,59.18 63.88,59.56 v62.36,59.56
MOSI  (via drill 0.6)
  Top 0.254: v68.2,61.85 67.22,60.87 IC1.15 62.07,60.87 61.47,61.47 61.47,64.01 60.33,65.15 50.16,65.15 47.37,67.95 47.37,71.12 IOH.4
  Bottom 0.254: v68.2,61.85 83.44,61.85 SV1.4
N$1  (via drill 0.6)
  Top 0.254: IC3.1 70.14,52.79 v71.75,51.18 71.75,36.2 70.1,34.54 64.9,34.54 61.21,38.23 U$1.4
  Bottom 0.254: LED4.K 85.98,44.45 85.09,45.34 73.79,45.34 71.75,47.37 v71.75,51.18
N$2  (via drill 0.6)
  Top 0.254: v61.59,54.86 IC3.7 | Q3.2 48.86,55.37 C12.1
  Bottom 0.254: Q3.2 61.09,55.37 v61.59,54.86
N$3  (via drill 0.6)
  Top 0.254: v71.75,52.71 71.75,53.34 70.87,54.23 68.45,54.23 68.07,53.85 68.07,52.92 IC3.2 | U$1.7 57.4,33.27 v58.17,32.51
  Bottom 0.254: v71.75,52.71 82.8,52.71 85.85,49.66 LED3.K 87.63,46.99 87.63,35.43 84.71,32.51 v58.17,32.51
N$4  (via drill 0.6)
  Top 0.254: IC2.17 19.31,52.07 19.69,52.45 23.62,52.45 24.13,51.94 24.13,48.86 C8.2 24.09,48.9 v22.48,48.9 | IC2.4 v14.11,45.6
  Bottom 0.254: v22.48,48.9 20.07,46.48 14.99,46.48 v14.11,45.6
N$5
  Top 0.254: JP1.D+ 19.69,47.62 20.57,48.51 20.57,51.09 IC2.15
N$6
  Top 0.254: IC2.16 19.96,48.91 19.3,48.26 7.75,48.26 JP1.D-
N$7  (via drill 0.6)  (1 unrouted)
  Top 0.254: v17.4,54.36 17.4,51.16 | JP1.VBUS 7.73,58.02 8.38,58.67 16.64,58.67 16.76,58.55 16.76,57.02 | 16.76,57.02 LED2.A | 16.76,57.02 LED1.A
  Bottom 0.254: LED2.A 18.03,54.99 v17.4,54.36
N$8
  Top 0.254: R1.2 9.31,57.02 LED1.K
N$9
  Top 0.254: LED2.K 25.36,57.02 R3.2
N$10
  Top 0.254: R1.1 14.57,55.28 15.49,54.36 15.49,51.21 IC2.23
N$11
  Top 0.254: R3.1 16.42,55.28 16,54.86 16,51.18 IC2.22
N$12  (via drill 0.6)
  Top 0.254: R2.1 80.73,48.68 v80.77,48.64
  Bottom 0.254: v80.77,48.64 83.19,48.64 LED3.A
N$13
  Top 0.254: LED4.A 78.53,43.31 R6.1
N$14  (via drill 0.6)
  Top 0.254: v10.16,28.19 10.16,27.56 10.92,26.8 24.42,26.8 C7.2
  Bottom 0.254: SV4.5 v10.16,28.19
N$15
  Top 0.254: IC2.1 12.16,41.88 11.56,41.28 11.56,38.73 12.7,37.59 16,37.59 16.51,37.08 16.51,34.8 SV3.4
N$16  (via drill 0.6)
  Top 0.305: IC2.5 14.76,41.63 v14.86,41.53
  Bottom 0.254: SV3.3 15.24,41.15 v14.86,41.53
N$17  (via drill 0.6)
  Top 0.254: IC2.2 12.81,41.64 12.32,41.15 12.32,39.24 13.08,38.48 v13.84,38.48
  Bottom 0.254: v13.84,38.48 13.97,38.35 13.97,32 SV4.3
N$18  (via drill 0.6)
  Top 0.254: v67.94,69.09 67.94,67.82 68.07,67.69 68.07,67.25 IC1.7 | C1.1 57.4,67.06 Q1.1
  Bottom 0.254: Q1.1 61.72,66.17 64.9,69.34 67.69,69.34 v67.94,69.09
N$19  (via drill 0.6)  (1 unrouted)
  Top 0.254: C2.1 v55.12,61.09 | v65.66,68.2 66.67,68.2 67.18,67.69
  Bottom 0.254: v55.12,61.09 Q1.2 58.55,61.09 v65.66,68.2
N$20  (via drill 0.6)
  Top 0.254: v60.45,50.29 60.45,52.67 IC3.8 | Q3.1 48.98,50.29 C11.1
  Bottom 0.254: Q3.1 v60.45,50.29
N$21
  pour Top: 0,0 0,37.72 0,37.85 1.91,37.85 1.91,58.04 0,58.04 0,95.89 36.07,95.89 36.07,92.96 56.39,92.96 56.39,95.89 90.17,95.89 90.17,0 75.31,0 75.31,4.45 15.11,4.45 15.11,0
N$22
  pour Bottom: 0,0 0,37.72 0,37.85 1.91,37.85 1.91,58.04 0,58.04 0,95.89 36.07,95.89 36.07,92.96 56.39,92.96 56.39,95.89 90.17,95.89 90.17,0 75.31,0 75.31,4.32 75.31,4.45 15.11,4.45 15.11,0
N$23  (via drill 0.6)
  Top 0.254: U$3.54 39.98,46.59 v41.66,48.26
  Bottom 0.254: v41.66,48.26 41.66,50.93 41.02,51.56 39.24,51.56 26.54,64.26 SV2.1
N$24  (via drill 0.6)
  Top 0.254: U$3.55 39.48,46.98 40.26,47.75 v40.26,48.51
  Bottom 0.254: v40.26,48.51 40.26,49.15 26.42,62.99 17.91,62.99 SV2.3
N$25  (via drill 0.6)
  Top 0.254: U$3.56 38.98,48.14 v38.73,48.39 | v24.38,61.72 24.38,64.14 21.08,67.44 v14.1,67.44
  Bottom 0.254: v38.73,48.39 38.73,48.9 26.04,61.59 24.51,61.59 v24.38,61.72 | SV2.5 v14.1,67.44
N$26  (via drill 0.6)
  Top 0.305: IC2.3 13.46,40.14 v13.59,40.01
  Bottom 0.254: SV4.4 15.24,27.94 14.1,26.8 9.4,26.8 8.51,27.69 8.51,37.72 10.67,39.88 13.46,39.88 v13.59,40.01
N$27  (via drill 0.6)
  Top 0.254: U$3.46 48.72,41.99 v49.4,42.67 | v65.41,45.47 IC3.15
  Bottom 0.254: v49.4,42.67 52.2,45.47 v65.41,45.47
N$28
  Top 0.254: IC3.14 64.14,42.04 63.59,41.49 U$3.45
N$29
  Top 0.254: IC3.13 62.87,42.42 62.48,42.04 52.07,42.04 50.16,43.94 48.26,43.94 46.81,42.49 U$3.47
N$31  (via drill 0.6)
  Top 0.254: IC3.16 66.67,37.21 v65.53,36.07 | v47.88,36.96 44.57,36.96 U$3.36
  Bottom 0.254: v65.53,36.07 48.77,36.07 v47.88,36.96
N$32
  Top 0.254: IC3.12 61.59,44.96 60.83,45.72 45.09,45.72 42.42,43.05 42.42,38.48 43.43,37.47 44.51,37.47 U$3.37
N$33  (via drill 0.6)
  Top 0.254: U$3.38 49.38,37.99 v50.04,37.34 | v68.2,38.35 68.2,42.96 IC3.17
  Bottom 0.254: v50.04,37.34 67.18,37.34 v68.2,38.35
RESET  (via drill 0.6)
  Top 0.254: S1.1 86.49,76.29 86.49,67.95 | v76.71,63.75 76.2,63.25 74.29,63.25 IC1.29 | 43.82,28.7 51.18,36.07 51.18,37.59 50.29,38.48 44.55,38.48 U$3.39 | 44.96,24.38 POWER.3 44.96,27.56 43.82,28.7 | C7.1 43.82,28.7 | SV1.5 86.49,67.95 | R14.1 86.45,67.98 86.49,67.95
  Bottom 0.254: v76.71,63.75 85.34,63.75 SV1.5 88.52,62.87 88.52,34.67 83.69,29.85 | POWER.3 44.96,22.99 45.47,22.48 48.13,22.48 48.77,23.11 48.77,27.05 51.56,29.85 83.69,29.85 | 83.69,29.85 83.82,29.85
RST/NMI  (via drill 0.6)
  Top 0.254: v26.92,49.28 27.98,50.33 R15.1 30.69,50.25 C6.1 35.98,50.29 36.83,50.29 37.08,50.04 37.08,46.61 37.47,46.23 37.72,46.23 37.98,45.96 U$3.58
  Bottom 0.254: SV4.1 26.92,39.88 v26.92,49.28
RX  (via drill 0.6)
  Top 0.254: 45.78,32.32 44.45,30.99 22.86,30.99 21.34,29.46 11.68,29.46 10.92,30.23 10.92,32.39 12.07,33.53 SV3.6 | 45.78,32.32 47.75,34.29 47.75,35.05 46.86,35.94 44.59,35.94 U$3.34 | v71.88,62.99 72.95,64.06 IC1.30 75.24,64.06 75.82,64.64 75.82,72.14 IOL.1 | v44.2,33.91 45.78,32.32
  Bottom 0.254: v71.88,62.99 63.5,62.99 58.93,58.42 47.37,58.42 46.48,57.53 46.48,50.42 40.39,44.32 40.39,39.75 41.02,39.12 41.02,37.08 v44.2,33.91
SCK  (via drill 0.6)
  Top 0.254: v67.18,56.52 IC1.17 66.9,58.29 60.83,58.29 60.07,59.06 60.07,62.61 58.8,63.88 49.28,63.88 40.89,72.26 IOH.6
  Bottom 0.254: SV1.3 87.63,61.21 87.63,59.06 86.61,58.04 68.71,58.04 v67.18,56.52
SS
  Top 0.254: IC1.14 62.67,61.67 61.98,62.36 61.98,64.26 57.4,68.83 52.07,68.83 48.51,72.39 IOH.3
TCK  (via drill 0.6)
  Top 0.254: v37.97,47.12 38.48,46.61 U$3.57 38.48,42.67 v38.61,42.55 | v22.1,61.59 22.1,64.77 20.83,66.04 11.94,66.04 11.56,65.66 SV2.7
  Bottom 0.254: SV4.2 26.67,28.19 38.48,40.01 38.48,42.42 v38.61,42.55 | v37.97,47.12 37.47,47.62 37.47,48.77 25.91,60.33 23.37,60.33 v22.1,61.59
TX  (via drill 0.6)
  Top 0.254: 42.97,36.49 41.02,34.54 26.8,34.54 25.15,32.89 19.81,32.89 19.05,32.13 14.35,32.13 13.97,32.51 13.97,34.8 SV3.5 | v71.75,64.9 71.79,64.87 IC1.31 75.15,64.87 75.31,65.02 75.31,66.42 74.68,67.06 74.68,70.74 IOL.2 | U$3.35 42.97,36.49 | 42.97,36.49 41.87,36.49 v39.88,38.48
  Bottom 0.254: v71.75,64.9 64.14,64.9 58.55,59.31 45.97,59.31 45.59,58.93 45.59,50.55 39.62,44.58 39.62,38.73 v39.88,38.48
XT2IN  (via drill 0.6)
  Top 0.254: C10.1 38.39,57.24 v38.73,56.9 | U$3.53 40.51,45.07 40.51,46.23 41.15,46.86 41.91,46.86 42.93,47.88 42.93,51.56 42.16,52.32 40.39,52.32 Q2.1
  Bottom 0.254: v38.73,56.9 Q2.1
XT2OUT  (via drill 0.6)
  Top 0.254: v44.45,57.02 44.45,59.73 C9.1 | U$3.52 40.98,45.94 41.4,46.36 42.42,46.36 43.82,47.75 Q2.2
  Bottom 0.254: Q2.2 43.82,56.39 v44.45,57.02

### Text on the board
tPlace: 13 | 12 | 11 | 10 | 9 | 8 | 7 | 6 | 5 | 4 | 3 | 2 | 1 | 0
214bmp: D:/SmartProjects/Snc/a4_bn_logo2.bmp